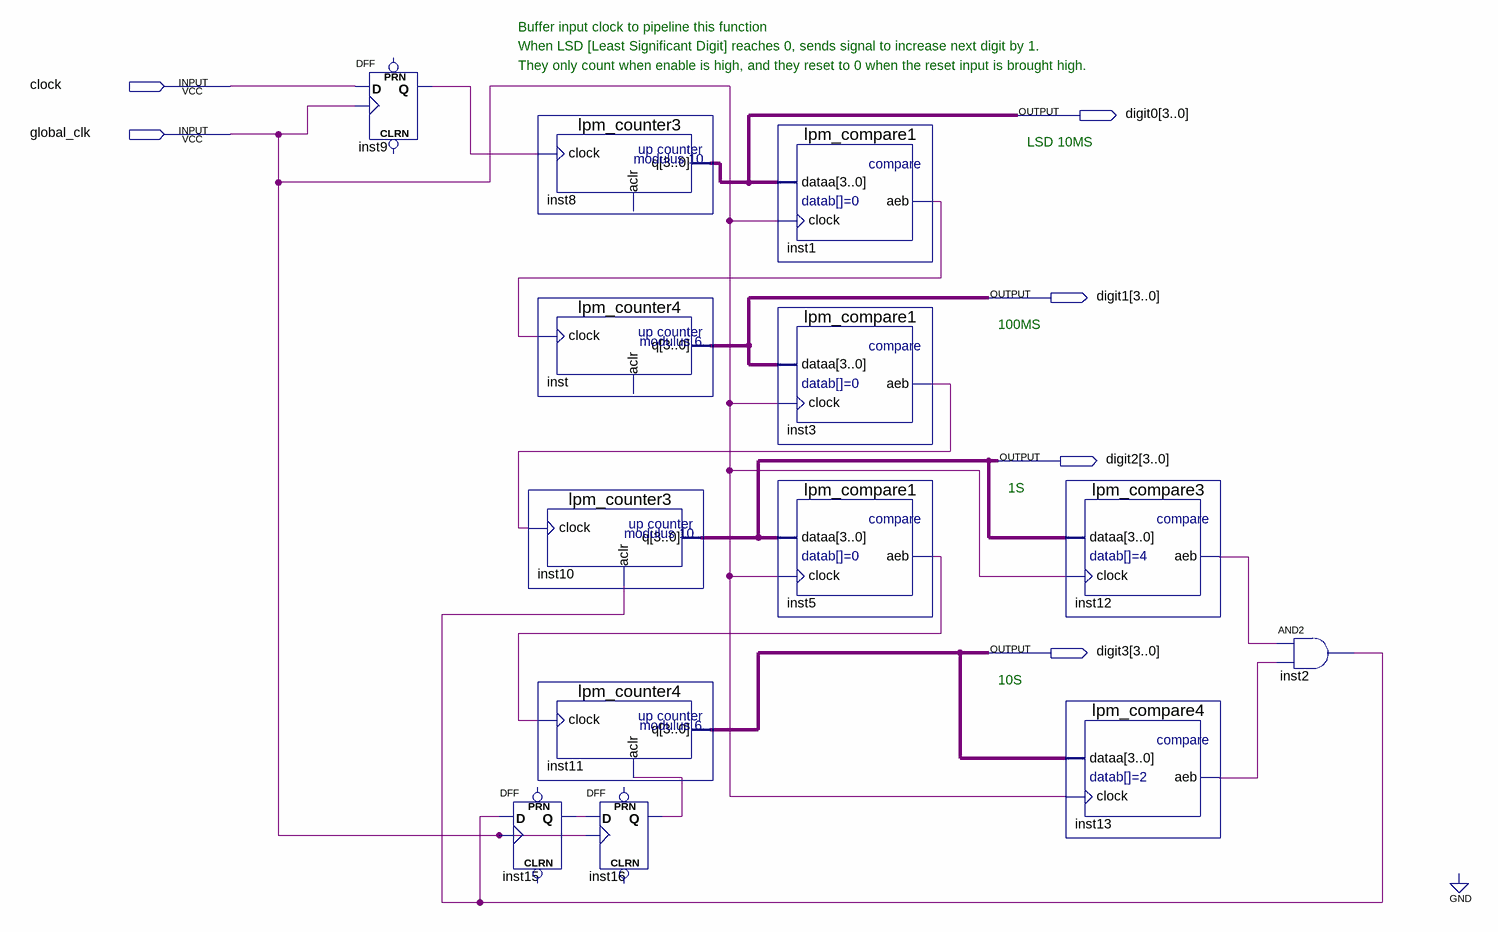
[diagram p0: schematic sheet]
// Quartus schematic clkBCDcount.bdf as structural Verilog: 13 symbols, 6 pins
module clkBCDcount (
  input  clock,
  input  global_clk,
  output [3:0] digit0,
  output [3:0] digit1,
  output [3:0] digit2,
  output [3:0] digit3
);

  wire inst1_aeb, inst2_out, inst3_aeb, inst5_aeb, inst9_q, inst12_aeb, inst13_aeb, inst15_q, inst16_q;

  DFF inst9 (.CLK(global_clk), .D(clock), .Q(inst9_q));  // open: CLRN, PRN
  lpm_counter3 inst8 (.clock(inst9_q), .q(digit0));  // open: aclr
  lpm_counter4 inst (.clock(inst1_aeb), .q(digit1));  // open: aclr
  lpm_counter3 inst10 (.clock(inst3_aeb), .aclr(inst2_out), .q(digit2));
  lpm_counter4 inst11 (.clock(inst5_aeb), .aclr(inst16_q), .q(digit3));
  DFF inst15 (.CLK(global_clk), .D(inst2_out), .Q(inst15_q));  // open: CLRN, PRN
  DFF inst16 (.CLK(global_clk), .D(inst15_q), .Q(inst16_q));  // open: CLRN, PRN
  lpm_compare1 inst1 (.dataa(digit0), .clock(global_clk), .aeb(inst1_aeb));
  lpm_compare1 inst3 (.dataa(digit1), .clock(global_clk), .aeb(inst3_aeb));
  lpm_compare1 inst5 (.dataa(digit2), .clock(global_clk), .aeb(inst5_aeb));
  lpm_compare3 inst12 (.dataa(digit2), .clock(global_clk), .aeb(inst12_aeb));
  lpm_compare4 inst13 (.dataa(digit3), .clock(global_clk), .aeb(inst13_aeb));
  and inst2 (inst2_out, inst12_aeb, inst13_aeb);

  // Notes on the sheet:
  //   Buffer input clock to pipeline this function
  //   When LSD [Least Significant Digit] reaches 0, sends signal to increase next digit by 1.
  //   They only count when enable is high, and they reset to 0 when the reset input is brought high.
  //   LSD 10MS
  //   100MS
  //   1S
  //   10S
endmodule
